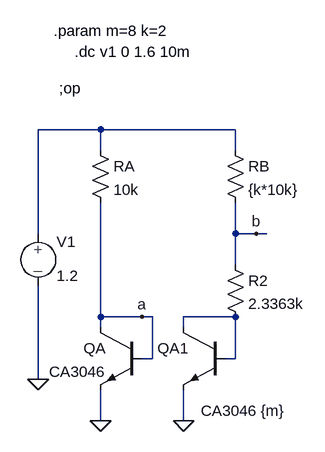
[diagram p0: schematic bgdiode.asc]
bgdiode.asc, the LTspice schematic file:
Version 4
SHEET 1 880 680
WIRE -112 -16 -208 -16
WIRE 96 -16 -112 -16
WIRE -112 16 -112 -16
WIRE 96 16 96 -16
WIRE -208 144 -208 -16
WIRE 96 144 96 96
WIRE 128 144 96 144
WIRE 144 144 128 144
WIRE 96 192 96 144
WIRE -112 272 -112 96
WIRE -48 272 -112 272
WIRE -32 272 -48 272
WIRE 96 272 16 272
WIRE -112 288 -112 272
WIRE 16 288 16 272
WIRE -32 336 -32 272
WIRE -32 336 -48 336
WIRE 96 336 96 272
WIRE 96 336 80 336
WIRE -208 368 -208 224
WIRE -112 432 -112 384
WIRE 16 432 16 384
FLAG -112 432 0
FLAG -48 272 a
FLAG 16 432 0
FLAG -208 368 0
FLAG 128 144 b
SYMBOL EIT_Semiconductors\\npn -48 288 M0
SYMATTR InstName QA
SYMATTR Value CA3046
SYMBOL res -128 0 R0
SYMATTR InstName RA
SYMATTR Value 10k
SYMBOL res 80 0 R0
SYMATTR InstName RB
SYMATTR Value {k*10k}
SYMBOL res 80 176 R0
SYMATTR InstName R2
SYMATTR Value 2.3363k
SYMBOL EIT_Semiconductors\\npn 80 288 M0
WINDOW 3 -93 128 Left 2
SYMATTR InstName QA1
SYMATTR Value CA3046 {m}
SYMBOL source-V -208 128 R0
SYMATTR InstName V1
SYMATTR Value 1.2
TEXT -184 -168 Left 2 !.param m=8 k=2
TEXT -152 -136 Left 2 !.dc v1 0 1.6 10m
TEXT -176 -80 Left 2 !;op

The netlist it stands for:
* bgdiode.asc
QA a a 0 0 CA3046
RA N001 a 10k
RB N001 b {k*10k}
R2 b N002 2.3363k
QA1 N002 N002 0 0 CA3046 {m}
V1 N001 0 1.2
.model NPN NPN
.model PNP PNP
.lib standard.bjt
.param m=8 k=2
.dc v1 0 1.6 10m
;op
.backanno
.end